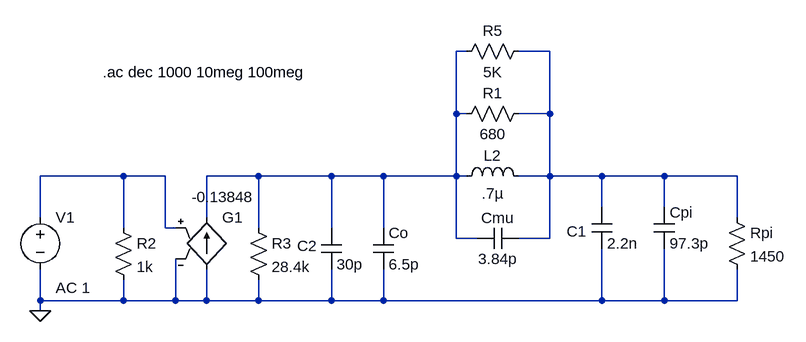
[diagram p0: schematic lc2.asc]
lc2.asc, the LTspice schematic file:
Version 4
SHEET 1 1012 680
WIRE 512 -96 496 -96
WIRE 640 -96 592 -96
WIRE 496 0 496 -96
WIRE 512 0 496 0
WIRE 640 0 640 -96
WIRE 640 0 592 0
WIRE -16 96 -144 96
WIRE 48 96 -16 96
WIRE 192 96 112 96
WIRE 304 96 192 96
WIRE 384 96 304 96
WIRE 496 96 496 0
WIRE 496 96 384 96
WIRE 512 96 496 96
WIRE 640 96 640 0
WIRE 640 96 592 96
WIRE 720 96 640 96
WIRE 816 96 720 96
WIRE 928 96 816 96
WIRE 720 144 720 96
WIRE 816 144 816 96
WIRE -144 160 -144 96
WIRE 112 160 112 96
WIRE 928 160 928 96
WIRE -16 176 -16 96
WIRE 48 176 48 96
WIRE 64 176 48 176
WIRE 192 176 192 96
WIRE 304 176 304 96
WIRE 384 176 384 96
WIRE 496 192 496 96
WIRE 528 192 496 192
WIRE 640 192 640 96
WIRE 640 192 592 192
WIRE -144 288 -144 240
WIRE -16 288 -16 256
WIRE -16 288 -144 288
WIRE 64 288 64 224
WIRE 64 288 -16 288
WIRE 112 288 112 240
WIRE 112 288 64 288
WIRE 192 288 192 256
WIRE 192 288 112 288
WIRE 304 288 304 240
WIRE 304 288 192 288
WIRE 384 288 384 240
WIRE 384 288 304 288
WIRE 720 288 720 208
WIRE 720 288 384 288
WIRE 816 288 816 208
WIRE 816 288 720 288
WIRE 928 288 928 240
WIRE 928 288 816 288
WIRE -144 304 -144 288
FLAG -144 304 0
SYMBOL res 608 -16 R90
WINDOW 0 0 56 VBottom 2
WINDOW 3 32 56 VTop 2
SYMATTR InstName R1
SYMATTR Value 680
SYMBOL ind 496 112 R270
WINDOW 0 32 56 VTop 2
WINDOW 3 5 56 VBottom 2
SYMATTR InstName L2
SYMATTR Value .7µ
SYMBOL cap 288 176 R0
WINDOW 0 -37 28 Left 2
SYMATTR InstName C2
SYMATTR Value 30p
SYMBOL cap 704 144 R0
WINDOW 0 -38 37 Left 2
SYMATTR InstName C1
SYMATTR Value 2.2n
SYMBOL res 608 -112 R90
WINDOW 0 0 56 VBottom 2
WINDOW 3 32 56 VTop 2
SYMATTR InstName R5
SYMATTR Value 5K
SYMBOL res -32 160 R0
SYMATTR InstName R2
SYMATTR Value 1k
SYMBOL voltage -144 144 R0
WINDOW 123 24 124 Left 2
WINDOW 39 0 0 Left 0
SYMATTR Value2 AC 1
SYMATTR InstName V1
SYMATTR Value ""
SYMBOL g 112 144 R0
WINDOW 3 -23 -16 Left 2
SYMATTR Value -0.13848
SYMATTR InstName G1
SYMBOL res 176 160 R0
SYMATTR InstName R3
SYMATTR Value 28.4k
SYMBOL cap 592 176 R90
WINDOW 0 0 32 VBottom 2
WINDOW 3 32 32 VTop 2
SYMATTR InstName Cmu
SYMATTR Value 3.84p
SYMBOL cap 800 144 R0
SYMATTR InstName Cpi
SYMATTR Value 97.3p
SYMBOL res 912 144 R0
SYMATTR InstName Rpi
SYMATTR Value 1450
SYMBOL cap 368 176 R0
SYMATTR InstName Co
SYMATTR Value 6.5p
TEXT -48 -64 Left 2 !.ac dec 1000 10meg 100meg

The netlist it stands for:
* lc2.asc
R1 N002 N001 680
L2 N001 N002 .7µ
C2 N001 0 30p
C1 N002 0 2.2n
R5 N002 N001 5K
R2 N003 0 1k
V1 N003 0 AC 1
G1 0 N001 N003 0 -0.13848
R3 N001 0 28.4k
Cmu N002 N001 3.84p
Cpi N002 0 97.3p
Rpi N002 0 1450
Co N001 0 6.5p
.ac dec 1000 10meg 100meg
.backanno
.end